# EAGLE design bbf-pots (EAGLE 9.6.2)
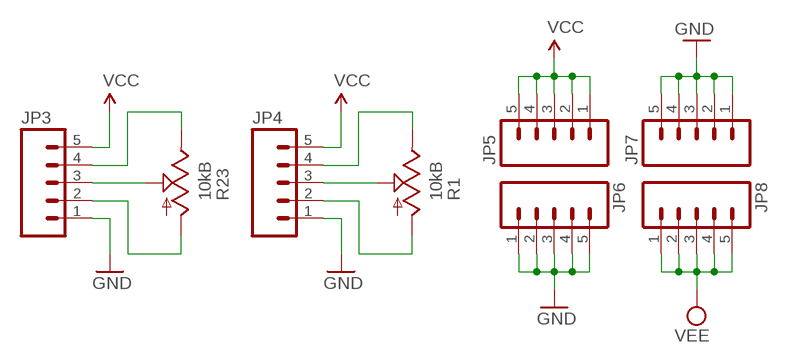
[diagram p0: schematic, sheet 1]

## Parts
JP3  M05PTH  [1X05]
JP4  M05PTH  [1X05]
JP5  M05PTH  [1X05]
JP6  M05PTH  [1X05]
JP7  M05PTH  [1X05]
JP8  M05PTH  [1X05]
R1  10kB  POT_USVERTICAL  [ALPS_POT_VERTICAL]
R23  10kB  POT_USVERTICAL  [ALPS_POT_VERTICAL]

## Nets
GND: JP3.1 JP4.1 JP6.1 JP6.2 JP6.3 JP6.4 JP6.5 JP7.1 JP7.2 JP7.3 JP7.4 JP7.5
N$2: JP3.4 R23.P$1(E)
N$3: JP3.3 R23.P$2(S)
N$4: JP3.2 R23.P$3(A)
N$5: JP4.4 R1.P$1(E)
N$6: JP4.3 R1.P$2(S)
N$7: JP4.2 R1.P$3(A)
VCC: JP3.5 JP4.5 JP5.1 JP5.2 JP5.3 JP5.4 JP5.5
VEE: JP8.1 JP8.2 JP8.3 JP8.4 JP8.5

## Library data of the parts
JP3-JP8 = SparkFun:M05: Header 5 Standard 5-pin 0.1" header. Use with straight break away headers (SKU : PRT-00116), right angle break away headers (PRT-00553), swiss pins (PRT-00743), machine pins (PRT-00117), and female headers (PRT-00115). Molex polarized connector foot print use with SKU : PRT-08230 with associated crimp pins and housings.
R1 R23 = pot-alps:POT_US

## Board
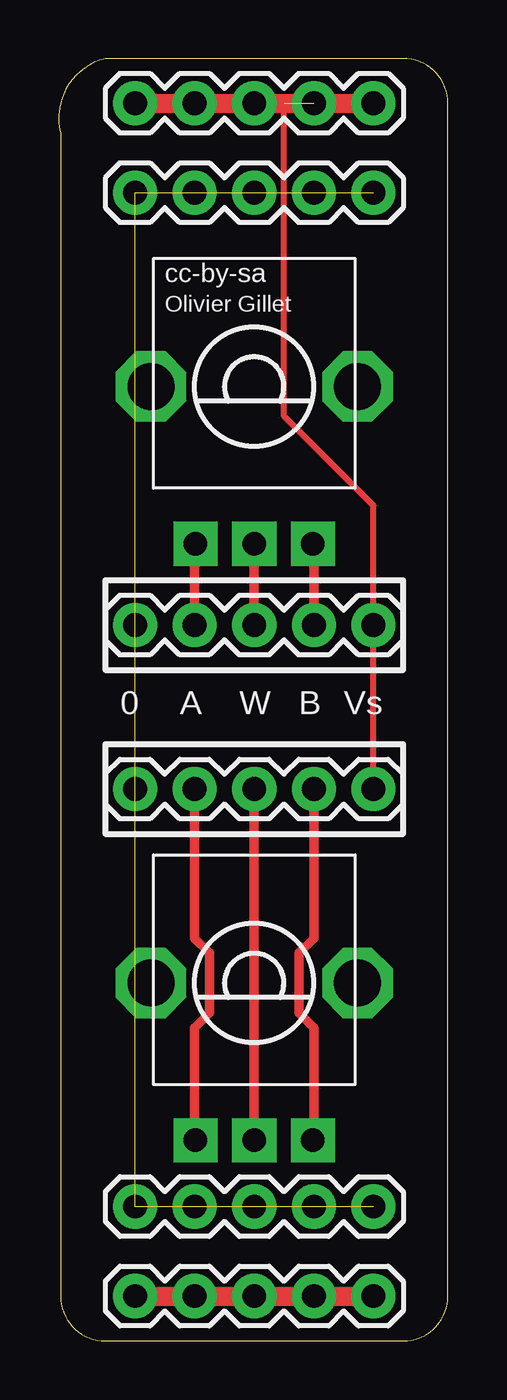
[diagram p1: board, top side]
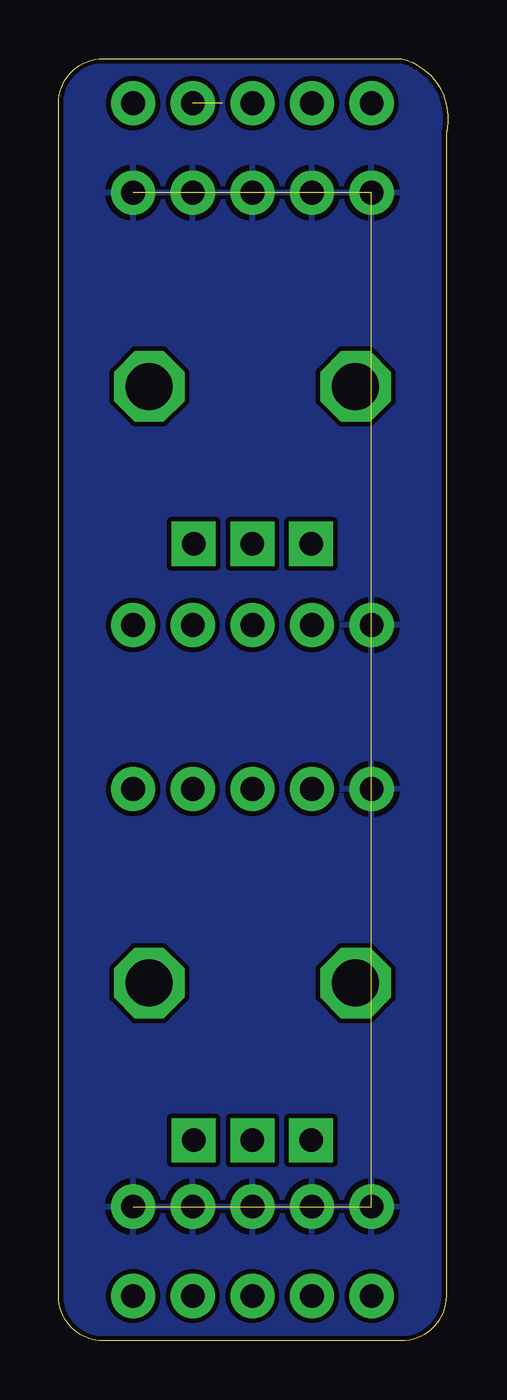
[diagram p2: board, bottom side, seen from below]

Size 16.59 x 54.6 mm. Coordinates in mm from the lower left corner, seen from the top.
Outline: 14.68,0 arc90 16.59,1.9 16.59,52.7 arc90 14.69,54.6 1.97,54.6 arc90 0.08,51.44 0.08,1.9 arc90 1.98,0 14.68,0
Copper layers (1*16): Top 0.035mm / dielectric 1.5mm / Bottom 0.035mm
Design rules "SparkFun_10mil *": minimum track width 8mil, minimum drill 20mil, track to track 8mil, track to pad 8mil, pad to pad 8mil, via to via 8mil, smd to smd 8mil, copper to edge 8mil, drill to drill 8mil, minimum pad ring 12mil, minimum via ring 10mil, stop-mask expansion 4mil, vias tented up to drill 25mil, thermal gap 10mil

### Footprints (pad centres in the part's own frame; a part is rotated, then mirrored left to right if it is on the bottom)
1X05 = drill 1.016 pad 1.88: 1 0,0; 2 2.54,0; 3 5.08,0; 4 7.62,0; 5 10.16,0
ALPS_POT_VERTICAL = drill 1 pad 1.88 square: P$1 -2.5,6.7; P$2 0,6.7; P$3 2.5,6.7 | drill 2 octagon: P$4 -4.4,0; P$5 4.4,0

### Placement (x,y rotation side)
JP3  3.25,30.48 0 top
JP4  3.25,23.49 0 top
JP5  3.25,52.7 0 top
JP6  3.25,48.89 0 top
JP7  3.25,5.71 0 top
JP8  3.25,1.9 0 top
R1  8.33,15.24 180 top
R23  8.33,40.64 180 top

### Tracks (layer width: path | path; a pad name or v marks a point on that pad's centre or on a via)
GND  (11 unrouted)
  pour Bottom: 14.68,0 arc90 16.59,1.9 16.59,52.7 arc90 14.68,54.61 2.62,54.61 arc90 0.08,52.07 0.08,1.9 arc90 1.98,0
N$2
  Top 0.406: R23.P$1 10.87,33.9 JP3.4
N$3
  Top 0.406: JP3.3 R23.P$2
N$4
  Top 0.406: R23.P$3 5.79,33.9 JP3.2
N$5
  Top 0.406: R1.P$1 10.87,8.58 10.87,13.34 10.24,13.97 10.24,16.51 10.87,17.14 JP4.4
N$6
  Top 0.406: R1.P$2 JP4.3
N$7
  Top 0.406: R1.P$3 5.79,8.58 5.79,13.34 6.43,13.97 6.43,16.51 5.79,17.14 JP4.2
VCC  (1 unrouted)
  Top 0.254: JP4.5 JP3.5 13.41,35.56 9.6,39.37 9.6,52.7
  Top 0.813: JP5.1 JP5.2 JP5.3 JP5.4 JP5.5
VEE
  Top 0.813: JP8.1 JP8.2 JP8.3 JP8.4 JP8.5

### Text on the board
tNames: cc-by-sa | Olivier Gillet | 0 | A | W | B | Vs